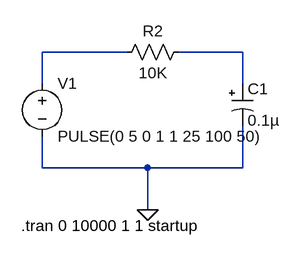
[diagram p0: schematic Draft4.asc]
Draft4.asc, the LTspice schematic file:
Version 4
SHEET 1 880 680
WIRE 224 96 96 96
WIRE 400 96 304 96
WIRE 96 144 96 96
WIRE 400 144 400 96
WIRE 96 272 96 224
WIRE 256 272 96 272
WIRE 400 272 400 208
WIRE 400 272 256 272
WIRE 256 336 256 272
FLAG 256 336 0
SYMBOL res 320 80 R90
WINDOW 0 0 56 VBottom 2
WINDOW 3 32 56 VTop 2
SYMATTR InstName R2
SYMATTR Value 10K
SYMATTR SpiceLine tol=1 pwr=0.1
SYMBOL polcap 384 144 R0
WINDOW 3 24 56 Left 2
SYMATTR Value 0.1µ
SYMATTR InstName C1
SYMATTR Description Capacitor
SYMATTR Type cap
SYMATTR SpiceLine V=16 Irms=0 Rser=11 Lser=0
SYMBOL voltage 96 128 R0
WINDOW 123 0 0 Left 0
WINDOW 39 0 0 Left 0
SYMATTR InstName V1
SYMATTR Value PULSE(0 5 0 1 1 25 100 50)
TEXT 64 360 Left 2 !.tran 0 10000 1 1 startup

The netlist it stands for:
* Draft4.asc
R2 N002 N001 10K tol=1 pwr=0.1
C1 N002 0 0.1µ V=16 Irms=0 Rser=11 Lser=0
V1 N001 0 PULSE(0 5 0 1 1 25 100 50)
.tran 0 10000 1 1 startup
.backanno
.end